# Altium project SOM_MODULE_LN_144201.PrjPcb (part 4 of 4)
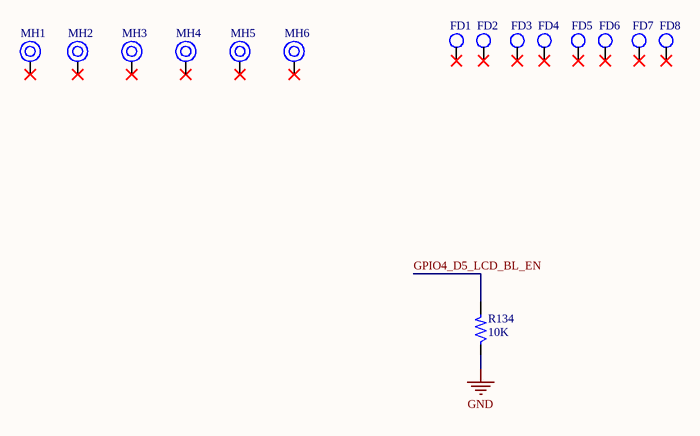
[diagram p19: Miscellaneous.SchDoc]

## Nets that join several sheets
GND: LPDDR4 SDRAM - 1 (107 pins), LPDDR4 SDRAM - 2 (107 pins), EMMC Flash memory (23 pins), WiFi module (27 pins), SOC SDRAM (22 pins), SOC Power Pins (287 pins), SOC EMMC, SDMMC, PCIE, ADC (11 pins), SOC Display, HDMI, EDP (17 pins), SOC USB, USIC (14 pins), SOC MIPI-CSI, I2C (6 pins), SOC PMU Controller (14 pins), SOC RGMII-SDIO, SPI (8 pins), USB C conn & ctrl (23 pins), ETH PHY IC (29 pins), BTNs and LEDs (Q1.2 SW2.1 SW3.1), PWR ICs (79 pins), PMIC (57 pins), DDR4 Conn (69 pins), Miscellaneous (R134.1)
VCC1V8_CAM: PMIC (C347.2 U20.31), DDR4 Conn (J5.107)
VCC3V3_S3: SOC USB, USIC (5 pins), SOC RGMII-SDIO, SPI (U8.J23), ETH PHY IC (C277.2 C278.2 R87.1), PMIC (C355.2 U20.7)
VCC3V3_S5: PWR ICs (C300.2 C301.2 C302.2 U15.5), PMIC (8 pins)
VCC3V3_SYS: WiFi module (5 pins), SOC PMU Controller (C236.2 U9.1), USB C conn & ctrl (C248.2 U10.4), BTNs and LEDs (SW1.1), PWR ICs (26 pins), PMIC (26 pins), DDR4 Conn (5 pins)
VCC5V0_SYS: WiFi module (C116.2 C117.2 U6.1 U6.6), USB C conn & ctrl (5 pins), BTNs and LEDs (R94.2), PWR ICs (5 pins), DDR4 Conn (J5.13 J5.15 J5.17 J5.19)
VCC_0V9: SOC SDRAM (FB4.2 FB6.2), SOC EMMC, SDMMC, PCIE, ADC (C197.2 C202.2 U8.L24 U8.W24), SOC Display, HDMI, EDP (6 pins), SOC USB, USIC (7 pins), SOC PMU Controller (FB1.1 U8.T24), PWR ICs (C321.2 L7.2 R121.2)
VCC_1V5: SOC RGMII-SDIO, SPI (C240.2 C243.2 U8.AC8 U8.N23), PMIC (C353.2 U20.2)
VCC_1V8: SOC EMMC, SDMMC, PCIE, ADC (8 pins), SOC Display, HDMI, EDP (7 pins), SOC USB, USIC (5 pins), SOC MIPI-CSI, I2C (12 pins), SOC PMU Controller (FB2.1 FB3.2), SOC RGMII-SDIO, SPI (C242.2 U8.AB8 U8.J22), PWR ICs (R99.2 R108.1 R116.2), PMIC (5 pins), DDR4 Conn (J5.29 J5.31)
VCC_3V0: SOC RGMII-SDIO, SPI (10 pins), PWR ICs (R112.1), PMIC (C344.2 C354.2 U20.15 U20.17)
VCC_DDR: LPDDR4 SDRAM - 1 (43 pins), LPDDR4 SDRAM - 2 (43 pins), SOC SDRAM (46 pins), PMIC (5 pins)
VCC_DDRC: LPDDR4 SDRAM - 1 (39 pins), LPDDR4 SDRAM - 2 (39 pins), PMIC (C363.2 Q5.2)
VCC_IN_CONN: PWR ICs (10 pins), PMIC (C362.1), DDR4 Conn (8 pins)
VCC_SDIO: SOC EMMC, SDMMC, PCIE, ADC (C195.2 U8.T23), PMIC (C351.2 U20.12)
VCCA1V8_CODEC: SOC RGMII-SDIO, SPI (5 pins), PMIC (C350.2 U20.5)
VDD_CENTER: SOC Power Pins (19 pins), PMIC (C329.2 C330.2 L9.1 U20.39)
VDD_CPU_B: SOC Power Pins (24 pins), PWR ICs (6 pins)
VDD_CPU_L: SOC Power Pins (16 pins), PMIC (C333.2 C334.2 L11.1 U20.29)
VDD_GPU: SOC Power Pins (37 pins), PWR ICs (5 pins)
VDD_LOG: SOC Power Pins (21 pins), PWR ICs (C306.2 L4.2 R107.2)
VDDQ: LPDDR4 SDRAM - 1 (R1.2 R2.1 R4.1), LPDDR4 SDRAM - 2 (R5.2 R6.1 R8.1)
ADC_IN0: SOC EMMC, SDMMC, PCIE, ADC (U8.AG26), DDR4 Conn (J5.26)
ADC_IN2: SOC EMMC, SDMMC, PCIE, ADC (U8.AG25), DDR4 Conn (J5.28)
ADC_IN3: SOC EMMC, SDMMC, PCIE, ADC (U8.AG28), DDR4 Conn (J5.30)
CPU_B_SLEEP: SOC RGMII-SDIO, SPI (U8.M27), PWR ICs (U13.A1)
DDR0_A0: LPDDR4 SDRAM - 1 (U1.H2 U1.R2), SOC SDRAM (U8.F2)
DDR0_A1: LPDDR4 SDRAM - 1 (U1.J2 U1.P2), SOC SDRAM (U8.F1)
DDR0_A2: LPDDR4 SDRAM - 1 (U1.H9 U1.R9), SOC SDRAM (U8.G1)
DDR0_A3: LPDDR4 SDRAM - 1 (U1.H10 U1.R10), SOC SDRAM (U8.G2)
DDR0_A4: LPDDR4 SDRAM - 1 (U1.H11 U1.R11), SOC SDRAM (U8.H2)
DDR0_A5: LPDDR4 SDRAM - 1 (U1.J11 U1.P11), SOC SDRAM (U8.H1)
DDR0_CKE0: LPDDR4 SDRAM - 1 (U1.J4 U1.P4), SOC SDRAM (U8.E1)
DDR0_CKE1: LPDDR4 SDRAM - 1 (U1.J5 U1.P5), SOC SDRAM (U8.F5)
DDR0_CLK1_N: LPDDR4 SDRAM - 1 (U1.P9), SOC SDRAM (U8.J5)
DDR0_CLK1_P: LPDDR4 SDRAM - 1 (U1.P8), SOC SDRAM (U8.H5)
DDR0_CLK_N: LPDDR4 SDRAM - 1 (U1.J9), SOC SDRAM (U8.J4)
DDR0_CLK_P: LPDDR4 SDRAM - 1 (U1.J8), SOC SDRAM (U8.H4)
DDR0_CS0N: LPDDR4 SDRAM - 1 (U1.H4), SOC SDRAM (U8.M6)
DDR0_CS1N: LPDDR4 SDRAM - 1 (U1.H3), SOC SDRAM (U8.B1)
DDR0_CS2N: LPDDR4 SDRAM - 1 (U1.R4), SOC SDRAM (U8.M5)
DDR0_CS3N: LPDDR4 SDRAM - 1 (U1.R3), SOC SDRAM (U8.C2)
DDR0_D0: LPDDR4 SDRAM - 1 (U1.B2), SOC SDRAM (U8.AB2)
DDR0_D1: LPDDR4 SDRAM - 1 (U1.C2), SOC SDRAM (U8.AB1)
DDR0_D2: LPDDR4 SDRAM - 1 (U1.E2), SOC SDRAM (U8.AA2)
DDR0_D3: LPDDR4 SDRAM - 1 (U1.F2), SOC SDRAM (U8.AA1)
DDR0_D4: LPDDR4 SDRAM - 1 (U1.F4), SOC SDRAM (U8.Y2)
DDR0_D5: LPDDR4 SDRAM - 1 (U1.E4), SOC SDRAM (U8.Y1)
DDR0_D6: LPDDR4 SDRAM - 1 (U1.C4), SOC SDRAM (U8.W1)
DDR0_D7: LPDDR4 SDRAM - 1 (U1.B4), SOC SDRAM (U8.W2)
DDR0_D8: LPDDR4 SDRAM - 1 (U1.B11), SOC SDRAM (U8.AF2)
DDR0_D9: LPDDR4 SDRAM - 1 (U1.C11), SOC SDRAM (U8.AE2)
DDR0_D10: LPDDR4 SDRAM - 1 (U1.E11), SOC SDRAM (U8.AF1)
DDR0_D11: LPDDR4 SDRAM - 1 (U1.F11), SOC SDRAM (U8.AD2)
DDR0_D12: LPDDR4 SDRAM - 1 (U1.F9), SOC SDRAM (U8.AE1)
DDR0_D13: LPDDR4 SDRAM - 1 (U1.E9), SOC SDRAM (U8.AD1)
DDR0_D14: LPDDR4 SDRAM - 1 (U1.C9), SOC SDRAM (U8.AC1)
DDR0_D15: LPDDR4 SDRAM - 1 (U1.B9), SOC SDRAM (U8.AC2)
DDR0_D16: LPDDR4 SDRAM - 1 (U1.AA2), SOC SDRAM (U8.V1)
DDR0_D17: LPDDR4 SDRAM - 1 (U1.Y2), SOC SDRAM (U8.V2)
DDR0_D18: LPDDR4 SDRAM - 1 (U1.V2), SOC SDRAM (U8.U1)
DDR0_D19: LPDDR4 SDRAM - 1 (U1.U2), SOC SDRAM (U8.U2)
DDR0_D20: LPDDR4 SDRAM - 1 (U1.U4), SOC SDRAM (U8.T1)
DDR0_D21: LPDDR4 SDRAM - 1 (U1.V4), SOC SDRAM (U8.T2)
DDR0_D22: LPDDR4 SDRAM - 1 (U1.Y4), SOC SDRAM (U8.R2)
DDR0_D23: LPDDR4 SDRAM - 1 (U1.AA4), SOC SDRAM (U8.R1)
DDR0_D24: LPDDR4 SDRAM - 1 (U1.AA11), SOC SDRAM (U8.P1)
DDR0_D25: LPDDR4 SDRAM - 1 (U1.Y11), SOC SDRAM (U8.P2)
DDR0_D26: LPDDR4 SDRAM - 1 (U1.V11), SOC SDRAM (U8.N1)
DDR0_D27: LPDDR4 SDRAM - 1 (U1.U11), SOC SDRAM (U8.M1)
DDR0_D28: LPDDR4 SDRAM - 1 (U1.U9), SOC SDRAM (U8.N2)
DDR0_D29: LPDDR4 SDRAM - 1 (U1.V9), SOC SDRAM (U8.L1)
DDR0_D30: LPDDR4 SDRAM - 1 (U1.Y9), SOC SDRAM (U8.M2)
DDR0_D31: LPDDR4 SDRAM - 1 (U1.AA9), SOC SDRAM (U8.L2)
DDR0_DM0: LPDDR4 SDRAM - 1 (U1.C3), SOC SDRAM (U8.Y5)
DDR0_DM1: LPDDR4 SDRAM - 1 (U1.C10), SOC SDRAM (U8.AC5)
DDR0_DM2: LPDDR4 SDRAM - 1 (U1.Y3), SOC SDRAM (U8.U5)
DDR0_DM3: LPDDR4 SDRAM - 1 (U1.Y10), SOC SDRAM (U8.P5)
DDR0_DQS0_N: LPDDR4 SDRAM - 1 (U1.E3), SOC SDRAM (U8.AA4)
DDR0_DQS0_P: LPDDR4 SDRAM - 1 (U1.D3), SOC SDRAM (U8.Y4)
DDR0_DQS1_N: LPDDR4 SDRAM - 1 (U1.E10), SOC SDRAM (U8.AD4)
DDR0_DQS1_P: LPDDR4 SDRAM - 1 (U1.D10), SOC SDRAM (U8.AC4)
DDR0_DQS2_N: LPDDR4 SDRAM - 1 (U1.W3), SOC SDRAM (U8.V4)
DDR0_DQS2_P: LPDDR4 SDRAM - 1 (U1.V3), SOC SDRAM (U8.U4)
DDR0_DQS3_N: LPDDR4 SDRAM - 1 (U1.V10), SOC SDRAM (U8.R4)
DDR0_DQS3_P: LPDDR4 SDRAM - 1 (U1.W10), SOC SDRAM (U8.P4)
DDR0_RST: LPDDR4 SDRAM - 1 (U1.T11), SOC SDRAM (U8.L7)
DDR1_A0: LPDDR4 SDRAM - 2 (U2.H2 U2.R2), SOC SDRAM (U8.B10)
DDR1_A1: LPDDR4 SDRAM - 2 (U2.J2 U2.P2), SOC SDRAM (U8.A10)
DDR1_A2: LPDDR4 SDRAM - 2 (U2.H9 U2.R9), SOC SDRAM (U8.B9)
DDR1_A3: LPDDR4 SDRAM - 2 (U2.H10 U2.R10), SOC SDRAM (U8.A9)
DDR1_A4: LPDDR4 SDRAM - 2 (U2.H11 U2.R11), SOC SDRAM (U8.B8)
DDR1_A5: LPDDR4 SDRAM - 2 (U2.J11 U2.P11), SOC SDRAM (U8.A8)
DDR1_CKE0: LPDDR4 SDRAM - 2 (U2.J4 U2.P4), SOC SDRAM (U8.A5)
DDR1_CKE1: LPDDR4 SDRAM - 2 (U2.J5 U2.P5), SOC SDRAM (U8.E6)
DDR1_CLK1_N: LPDDR4 SDRAM - 2 (U2.P9), SOC SDRAM (U8.E8)
DDR1_CLK1_P: LPDDR4 SDRAM - 2 (U2.P8), SOC SDRAM (U8.E9)
DDR1_CLK_N: LPDDR4 SDRAM - 2 (U2.J9), SOC SDRAM (U8.D8)
DDR1_CLK_P: LPDDR4 SDRAM - 2 (U2.J8), SOC SDRAM (U8.D9)
DDR1_CS0N: LPDDR4 SDRAM - 2 (U2.H4), SOC SDRAM (U8.F12)
DDR1_CS1N: LPDDR4 SDRAM - 2 (U2.H3), SOC SDRAM (U8.A2)
DDR1_CS2N: LPDDR4 SDRAM - 2 (U2.R4), SOC SDRAM (U8.F11)
DDR1_CS3N: LPDDR4 SDRAM - 2 (U2.R3), SOC SDRAM (U8.B3)
DDR1_D0: LPDDR4 SDRAM - 2 (U2.B2), SOC SDRAM (U8.B15)
DDR1_D1: LPDDR4 SDRAM - 2 (U2.C2), SOC SDRAM (U8.A15)
DDR1_D2: LPDDR4 SDRAM - 2 (U2.E2), SOC SDRAM (U8.B16)
DDR1_D3: LPDDR4 SDRAM - 2 (U2.F2), SOC SDRAM (U8.A16)
DDR1_D4: LPDDR4 SDRAM - 2 (U2.F4), SOC SDRAM (U8.B17)
DDR1_D5: LPDDR4 SDRAM - 2 (U2.E4), SOC SDRAM (U8.A17)
DDR1_D6: LPDDR4 SDRAM - 2 (U2.C4), SOC SDRAM (U8.A18)
DDR1_D7: LPDDR4 SDRAM - 2 (U2.B4), SOC SDRAM (U8.B18)
DDR1_D8: LPDDR4 SDRAM - 2 (U2.B11), SOC SDRAM (U8.B11)
DDR1_D9: LPDDR4 SDRAM - 2 (U2.C11), SOC SDRAM (U8.B12)
DDR1_D10: LPDDR4 SDRAM - 2 (U2.E11), SOC SDRAM (U8.A11)
DDR1_D11: LPDDR4 SDRAM - 2 (U2.F11), SOC SDRAM (U8.B13)
DDR1_D12: LPDDR4 SDRAM - 2 (U2.F9), SOC SDRAM (U8.A12)
DDR1_D13: LPDDR4 SDRAM - 2 (U2.E9), SOC SDRAM (U8.A13)
DDR1_D14: LPDDR4 SDRAM - 2 (U2.C9), SOC SDRAM (U8.A14)
DDR1_D15: LPDDR4 SDRAM - 2 (U2.B9), SOC SDRAM (U8.B14)
DDR1_D16: LPDDR4 SDRAM - 2 (U2.AA2), SOC SDRAM (U8.A19)
DDR1_D17: LPDDR4 SDRAM - 2 (U2.Y2), SOC SDRAM (U8.B19)
DDR1_D18: LPDDR4 SDRAM - 2 (U2.V2), SOC SDRAM (U8.A20)
DDR1_D19: LPDDR4 SDRAM - 2 (U2.U2), SOC SDRAM (U8.B20)
DDR1_D20: LPDDR4 SDRAM - 2 (U2.U4), SOC SDRAM (U8.A21)
DDR1_D21: LPDDR4 SDRAM - 2 (U2.V4), SOC SDRAM (U8.B21)
DDR1_D22: LPDDR4 SDRAM - 2 (U2.Y4), SOC SDRAM (U8.B22)
DDR1_D23: LPDDR4 SDRAM - 2 (U2.AA4), SOC SDRAM (U8.A22)
DDR1_D24: LPDDR4 SDRAM - 2 (U2.AA11), SOC SDRAM (U8.A23)
DDR1_D25: LPDDR4 SDRAM - 2 (U2.Y11), SOC SDRAM (U8.B23)
DDR1_D26: LPDDR4 SDRAM - 2 (U2.V11), SOC SDRAM (U8.A24)
DDR1_D27: LPDDR4 SDRAM - 2 (U2.U11), SOC SDRAM (U8.A25)
DDR1_D28: LPDDR4 SDRAM - 2 (U2.U9), SOC SDRAM (U8.B24)
DDR1_D29: LPDDR4 SDRAM - 2 (U2.V9), SOC SDRAM (U8.A26)
DDR1_D30: LPDDR4 SDRAM - 2 (U2.Y9), SOC SDRAM (U8.B25)
DDR1_D31: LPDDR4 SDRAM - 2 (U2.AA9), SOC SDRAM (U8.B26)
DDR1_DM0: LPDDR4 SDRAM - 2 (U2.C3), SOC SDRAM (U8.E17)
DDR1_DM1: LPDDR4 SDRAM - 2 (U2.C10), SOC SDRAM (U8.E14)
DDR1_DM2: LPDDR4 SDRAM - 2 (U2.Y3), SOC SDRAM (U8.E20)
DDR1_DM3: LPDDR4 SDRAM - 2 (U2.Y10), SOC SDRAM (U8.E23)
DDR1_DQS0_N: LPDDR4 SDRAM - 2 (U2.E3), SOC SDRAM (U8.D17)
DDR1_DQS0_P: LPDDR4 SDRAM - 2 (U2.D3), SOC SDRAM (U8.D18)
DDR1_DQS1_N: LPDDR4 SDRAM - 2 (U2.E10), SOC SDRAM (U8.D14)
DDR1_DQS1_P: LPDDR4 SDRAM - 2 (U2.D10), SOC SDRAM (U8.D15)
DDR1_DQS2_N: LPDDR4 SDRAM - 2 (U2.W3), SOC SDRAM (U8.D20)
DDR1_DQS2_P: LPDDR4 SDRAM - 2 (U2.V3), SOC SDRAM (U8.D21)
DDR1_DQS3_N: LPDDR4 SDRAM - 2 (U2.V10), SOC SDRAM (U8.D23)
DDR1_DQS3_P: LPDDR4 SDRAM - 2 (U2.W10), SOC SDRAM (U8.D24)
DDR1_RST: LPDDR4 SDRAM - 2 (U2.T11), SOC SDRAM (U8.G11)
EDP_TX0_N: SOC Display, HDMI, EDP (C205.1), DDR4 Conn (J5.249)
EDP_TX0_P: SOC Display, HDMI, EDP (C204.1), DDR4 Conn (J5.251)
EDP_TX1_N: SOC Display, HDMI, EDP (C207.1), DDR4 Conn (J5.243)
EDP_TX1_P: SOC Display, HDMI, EDP (C206.1), DDR4 Conn (J5.245)
EDP_TX2_N: SOC Display, HDMI, EDP (C209.1), DDR4 Conn (J5.237)
EDP_TX2_P: SOC Display, HDMI, EDP (C208.1), DDR4 Conn (J5.239)
EDP_TX3_N: SOC Display, HDMI, EDP (C213.1), DDR4 Conn (J5.231)
EDP_TX3_P: SOC Display, HDMI, EDP (C210.1), DDR4 Conn (J5.233)
EDPAUX_N: SOC Display, HDMI, EDP (U8.A28), DDR4 Conn (J5.257)
EDPAUX_P: SOC Display, HDMI, EDP (U8.B28), DDR4 Conn (J5.255)
EFUSE_VQPS_EN_H: SOC PMU Controller (U9.3), SOC RGMII-SDIO, SPI (U8.AK3)
EMMC_CLKO: EMMC Flash memory (U3.M5), SOC EMMC, SDMMC, PCIE, ADC (R19.2)
EMMC_CMD: EMMC Flash memory (U3.M6), SOC EMMC, SDMMC, PCIE, ADC (U8.J31)
EMMC_D0: EMMC Flash memory (U3.A3), SOC EMMC, SDMMC, PCIE, ADC (U8.J28)
EMMC_D1: EMMC Flash memory (U3.A4), SOC EMMC, SDMMC, PCIE, ADC (U8.J29)
EMMC_D2: EMMC Flash memory (U3.A5), SOC EMMC, SDMMC, PCIE, ADC (U8.J30)
EMMC_D3: EMMC Flash memory (U3.B2), SOC EMMC, SDMMC, PCIE, ADC (U8.J25)
EMMC_D4: EMMC Flash memory (U3.B3), SOC EMMC, SDMMC, PCIE, ADC (U8.J26)
EMMC_D5: EMMC Flash memory (U3.B4), SOC EMMC, SDMMC, PCIE, ADC (U8.J27)
EMMC_D6: EMMC Flash memory (U3.B5), SOC EMMC, SDMMC, PCIE, ADC (U8.L31)
EMMC_D7: EMMC Flash memory (U3.B6), SOC EMMC, SDMMC, PCIE, ADC (U8.K30)
EMMC_STRB: EMMC Flash memory (U3.H5), SOC EMMC, SDMMC, PCIE, ADC (U8.K31)
GPIO0_A2: SOC PMU Controller (U8.N24), DDR4 Conn (J5.37)
GPIO0_A6/PWM3A_IR: SOC PMU Controller (U8.P25), DDR4 Conn (J5.49)
GPIO0_B5/LED1_OUT: SOC PMU Controller (U8.P24), BTNs and LEDs (R95.1)
GPIO1_A0: SOC RGMII-SDIO, SPI (U8.R25), DDR4 Conn (J5.34)
GPIO1_A1: SOC RGMII-SDIO, SPI (U8.T31), DDR4 Conn (J5.36)
GPIO1_A2_CC_INT_L: SOC RGMII-SDIO, SPI (U8.R26), USB C conn & ctrl (U10.5)
GPIO1_A3: SOC RGMII-SDIO, SPI (U8.R27), DDR4 Conn (J5.38)
GPIO1_A4: SOC RGMII-SDIO, SPI (U8.R28), DDR4 Conn (J5.40)
GPIO1_B5_TP_RST: SOC RGMII-SDIO, SPI (U8.M24), DDR4 Conn (J5.82)
GPIO1_C2: SOC RGMII-SDIO, SPI (U8.N31), DDR4 Conn (J5.42)
GPIO1_C4_TP_INT: SOC RGMII-SDIO, SPI (U8.M29), DDR4 Conn (J5.84)
GPIO1_C6: SOC RGMII-SDIO, SPI (U8.L25), DDR4 Conn (J5.44)
GPIO1_C7: SOC RGMII-SDIO, SPI (U8.M31), DDR4 Conn (J5.46)
GPIO1_D0: SOC RGMII-SDIO, SPI (U8.L26), DDR4 Conn (J5.48)
GPIO2_A2: SOC MIPI-CSI, I2C (U8.H30), DDR4 Conn (J5.39)
GPIO2_A3: SOC MIPI-CSI, I2C (U8.F28), DDR4 Conn (J5.41)
GPIO2_A4: SOC MIPI-CSI, I2C (U8.H29), DDR4 Conn (J5.43)
GPIO2_A5: SOC MIPI-CSI, I2C (U8.F29), DDR4 Conn (J5.45)
GPIO2_A6: SOC MIPI-CSI, I2C (U8.H27), DDR4 Conn (J5.47)
GPIO2_B3_CIF_CLKOUTA: SOC MIPI-CSI, I2C (U8.H31), DDR4 Conn (J5.111)
GPIO4_C0/I2C3_SDA: SOC RGMII-SDIO, SPI (U8.AG6), DDR4 Conn (J5.68)
GPIO4_C1/I2C3_SCL: SOC RGMII-SDIO, SPI (U8.AL2), DDR4 Conn (J5.66)
GPIO4_C5/SPDIF_TX: SOC RGMII-SDIO, SPI (U8.AK1), DDR4 Conn (J5.50)
GPIO4_C6/PWM1: SOC RGMII-SDIO, SPI (U8.AL3), DDR4 Conn (J5.90)
GPIO4_D2: SOC RGMII-SDIO, SPI (U8.AH3), USB C conn & ctrl (U11.4)
GPIO4_D5_LCD_BL_EN: SOC RGMII-SDIO, SPI (U8.AJ3), DDR4 Conn (J5.78), Miscellaneous (R134.2)
GPIO4_D6_LCD_RST_H: SOC RGMII-SDIO, SPI (U8.AG4), DDR4 Conn (J5.80)
GPU_SLEEP: SOC RGMII-SDIO, SPI (U8.M25), PWR ICs (U18.A1)
HDMI_CEC: SOC RGMII-SDIO, SPI (U8.AD7), DDR4 Conn (J5.145)
HDMI_HPD: SOC Display, HDMI, EDP (D1.K R25.2 U8.AE15), DDR4 Conn (J5.147)
HDMI_TX0_N: SOC Display, HDMI, EDP (U8.AL17), DDR4 Conn (J5.157)
HDMI_TX0_P: SOC Display, HDMI, EDP (U8.AK17), DDR4 Conn (J5.159)
HDMI_TX1_N: SOC Display, HDMI, EDP (U8.AL18), DDR4 Conn (J5.163)
HDMI_TX1_P: SOC Display, HDMI, EDP (U8.AK18), DDR4 Conn (J5.165)
HDMI_TX2_N: SOC Display, HDMI, EDP (U8.AL19), DDR4 Conn (J5.169)
HDMI_TX2_P: SOC Display, HDMI, EDP (U8.AK19), DDR4 Conn (J5.171)
HDMI_TXCLK_N: SOC Display, HDMI, EDP (U8.AL16), DDR4 Conn (J5.151)
HDMI_TXCLK_P: SOC Display, HDMI, EDP (U8.AK16), DDR4 Conn (J5.153)
HOST0_D_N: SOC USB, USIC (U8.AB31), DDR4 Conn (J5.221)
HOST0_D_P: SOC USB, USIC (U8.AB30), DDR4 Conn (J5.219)
HOST1_D_N: SOC USB, USIC (U8.AA31), DDR4 Conn (J5.227)
HOST1_D_P: SOC USB, USIC (U8.AA30), DDR4 Conn (J5.225)
HP_DET_H: SOC RGMII-SDIO, SPI (U8.AH5), DDR4 Conn (J5.76)
I2C1_SCL: SOC RGMII-SDIO, SPI (R64.1 U8.Y6), DDR4 Conn (J5.53)
I2C1_SDA: SOC RGMII-SDIO, SPI (R63.1 U8.AG1), DDR4 Conn (J5.55)
I2C2_SCL: SOC MIPI-CSI, I2C (R38.1 U8.H25), DDR4 Conn (J5.59)
I2C2_SDA: SOC MIPI-CSI, I2C (R37.1 U8.G31), DDR4 Conn (J5.57)
I2C4_TPSCL: SOC RGMII-SDIO, SPI (R53.1 U8.P30), USB C conn & ctrl (U10.6), DDR4 Conn (J5.70)
I2C4_TPSDA: SOC RGMII-SDIO, SPI (R54.1 U8.P31), USB C conn & ctrl (U10.7), DDR4 Conn (J5.72)
I2C7_SCL_HDMI: SOC MIPI-CSI, I2C (R41.1 U8.H28), DDR4 Conn (J5.61)
I2C7_SDA_HDMI: SOC MIPI-CSI, I2C (R42.1 U8.G30), DDR4 Conn (J5.63)
I2C_SCL_PMIC: SOC RGMII-SDIO, SPI (R52.1 U8.N30), PWR ICs (U13.A3 U18.A3), PMIC (U20.19)
I2C_SDA_PMIC: SOC RGMII-SDIO, SPI (R55.1 U8.M26), PWR ICs (U13.B1 U18.B1), PMIC (U20.18)
I2S0_LRCK_RX: SOC RGMII-SDIO, SPI (U8.AF4), DDR4 Conn (J5.69)
I2S0_LRCK_TX: SOC RGMII-SDIO, SPI (U8.AJ2), DDR4 Conn (J5.71)
I2S0_SCLK: SOC RGMII-SDIO, SPI (U8.AG3), DDR4 Conn (J5.67)
I2S0_SDI0: SOC RGMII-SDIO, SPI (U8.Y7), DDR4 Conn (J5.73)
I2S0_SDI1SDO3: SOC RGMII-SDIO, SPI (U8.AE5), DDR4 Conn (J5.75)
I2S0_SDI2SDO2: SOC RGMII-SDIO, SPI (U8.AA6), DDR4 Conn (J5.77)
I2S0_SDI3SDO1: SOC RGMII-SDIO, SPI (U8.AH2), DDR4 Conn (J5.79)
I2S0_SDO0: SOC RGMII-SDIO, SPI (U8.AH1), DDR4 Conn (J5.81)
I2S1_LRCK_RX: SOC RGMII-SDIO, SPI (U8.AA7), DDR4 Conn (J5.91)
I2S1_LRCK_TX: SOC RGMII-SDIO, SPI (U8.AJ1), DDR4 Conn (J5.93)
I2S1_SCLK: SOC RGMII-SDIO, SPI (U8.AF3), DDR4 Conn (J5.89)
I2S1_SDI0: SOC RGMII-SDIO, SPI (U8.AD6), DDR4 Conn (J5.95)
I2S1_SDO0: SOC RGMII-SDIO, SPI (U8.AC6), DDR4 Conn (J5.97)
I2S_CLK: SOC RGMII-SDIO, SPI (U8.AC7), DDR4 Conn (J5.85)
LAN_LED0_AD0: ETH PHY IC (R80.1 U12.34), DDR4 Conn (J5.232)
LAN_LED0_AD1: ETH PHY IC (R78.2 U12.35), DDR4 Conn (J5.234)
LOG_DVS_PWM: SOC RGMII-SDIO, SPI (U8.M28), PWR ICs (R109.1 R112.2)
MAC_COL: SOC RGMII-SDIO, SPI (U8.D27), ETH PHY IC (R81.1 U12.33)
MAC_CRS: SOC RGMII-SDIO, SPI (U8.B27), ETH PHY IC (C267.2 R73.1 U12.29)
MAC_MCLK: SOC RGMII-SDIO, SPI (R56.2), ETH PHY IC (R74.1)
MAC_MDC: SOC RGMII-SDIO, SPI (U8.E29), ETH PHY IC (U12.30)
MAC_MDIO: SOC RGMII-SDIO, SPI (U8.G26), ETH PHY IC (R71.1 U12.31)
MAC_RXCLK: SOC RGMII-SDIO, SPI (U8.F25), ETH PHY IC (R76.1)
MAC_RXD0: SOC RGMII-SDIO, SPI (U8.E26), ETH PHY IC (R89.1 U12.14)
MAC_RXD1: SOC RGMII-SDIO, SPI (U8.F27), ETH PHY IC (R82.2 R83.1 U12.16)
MAC_RXD2: SOC RGMII-SDIO, SPI (U8.E30), ETH PHY IC (R91.1 U12.17)
MAC_RXD3: SOC RGMII-SDIO, SPI (U8.E25), ETH PHY IC (R93.1 U12.18)
MAC_RXDV: SOC RGMII-SDIO, SPI (U8.C27), ETH PHY IC (R79.2 U12.13)
MAC_RXER: SOC RGMII-SDIO, SPI (U8.F23), ETH PHY IC (R72.1 U12.20)
MAC_TXCLK: SOC RGMII-SDIO, SPI (R58.2), ETH PHY IC (R77.1)
MAC_TXD0: SOC RGMII-SDIO, SPI (R50.2), ETH PHY IC (U12.23)
MAC_TXD1: SOC RGMII-SDIO, SPI (R51.2), ETH PHY IC (U12.24)
MAC_TXD2: SOC RGMII-SDIO, SPI (R48.2), ETH PHY IC (U12.25)
MAC_TXD3: SOC RGMII-SDIO, SPI (R49.2), ETH PHY IC (U12.26)
MAC_TXEN: SOC RGMII-SDIO, SPI (R57.2), ETH PHY IC (U12.27)
MDI0_N: ETH PHY IC (U12.2), DDR4 Conn (J5.256)
MDI0_P: ETH PHY IC (U12.1), DDR4 Conn (J5.258)
MDI1_N: ETH PHY IC (U12.5), DDR4 Conn (J5.250)
MDI1_P: ETH PHY IC (U12.4), DDR4 Conn (J5.252)
MDI2_N: ETH PHY IC (U12.8), DDR4 Conn (J5.244)
MDI2_P: ETH PHY IC (U12.7), DDR4 Conn (J5.246)
MDI3_N: ETH PHY IC (U12.11), DDR4 Conn (J5.238)
MDI3_P: ETH PHY IC (U12.10), DDR4 Conn (J5.240)
MIPI_CSI0_PWM: SOC RGMII-SDIO, SPI (U8.AF8), DDR4 Conn (J5.101)
MIPI_CSI0_RST: SOC RGMII-SDIO, SPI (U8.AD9), DDR4 Conn (J5.99)
MIPI_CSI1_PWN: SOC PMU Controller (U8.V26), DDR4 Conn (J5.105)
MIPI_CSI1_RST: SOC PMU Controller (U8.U28), DDR4 Conn (J5.103)
MIPI_RX0_CLK_N: SOC MIPI-CSI, I2C (U8.AL13), DDR4 Conn (J5.127)
MIPI_RX0_CLK_P: SOC MIPI-CSI, I2C (U8.AK13), DDR4 Conn (J5.129)
MIPI_RX0_D0_N: SOC MIPI-CSI, I2C (U8.AL15), DDR4 Conn (J5.139)
MIPI_RX0_D0_P: SOC MIPI-CSI, I2C (U8.AK15), DDR4 Conn (J5.141)
MIPI_RX0_D1_N: SOC MIPI-CSI, I2C (U8.AL14), DDR4 Conn (J5.133)
MIPI_RX0_D1_P: SOC MIPI-CSI, I2C (U8.AK14), DDR4 Conn (J5.135)
MIPI_RX0_D2_N: SOC MIPI-CSI, I2C (U8.AL12), DDR4 Conn (J5.121)
MIPI_RX0_D2_P: SOC MIPI-CSI, I2C (U8.AK12), DDR4 Conn (J5.123)
MIPI_RX0_D3_N: SOC MIPI-CSI, I2C (U8.AL11), DDR4 Conn (J5.115)
MIPI_RX0_D3_P: SOC MIPI-CSI, I2C (U8.AK11), DDR4 Conn (J5.117)
MIPI_TX0_CLK_N: SOC Display, HDMI, EDP (U8.AH12), DDR4 Conn (J5.160)
MIPI_TX0_CLK_P: SOC Display, HDMI, EDP (U8.AG12), DDR4 Conn (J5.162)
MIPI_TX0_D0_N: SOC Display, HDMI, EDP (U8.AH15), DDR4 Conn (J5.172)
MIPI_TX0_D0_P: SOC Display, HDMI, EDP (U8.AG15), DDR4 Conn (J5.174)
MIPI_TX0_D1_N: SOC Display, HDMI, EDP (U8.AH14), DDR4 Conn (J5.166)
MIPI_TX0_D1_P: SOC Display, HDMI, EDP (U8.AG14), DDR4 Conn (J5.168)
MIPI_TX0_D2_N: SOC Display, HDMI, EDP (U8.AH11), DDR4 Conn (J5.154)
MIPI_TX0_D2_P: SOC Display, HDMI, EDP (U8.AG11), DDR4 Conn (J5.156)
MIPI_TX0_D3_N: SOC Display, HDMI, EDP (U8.AH9), DDR4 Conn (J5.148)
MIPI_TX0_D3_P: SOC Display, HDMI, EDP (U8.AG9), DDR4 Conn (J5.150)
MIPI_TX1/RX1_CLK_N: SOC MIPI-CSI, I2C (U8.AL8), DDR4 Conn (J5.128)
MIPI_TX1/RX1_CLK_P: SOC MIPI-CSI, I2C (U8.AK8), DDR4 Conn (J5.130)
MIPI_TX1/RX1_D0_N: SOC MIPI-CSI, I2C (U8.AL6), DDR4 Conn (J5.116)
MIPI_TX1/RX1_D0_P: SOC MIPI-CSI, I2C (U8.AK6), DDR4 Conn (J5.118)
MIPI_TX1/RX1_D1_N: SOC MIPI-CSI, I2C (U8.AL7), DDR4 Conn (J5.122)
MIPI_TX1/RX1_D1_P: SOC MIPI-CSI, I2C (U8.AK7), DDR4 Conn (J5.124)
MIPI_TX1/RX1_D2_N: SOC MIPI-CSI, I2C (U8.AL9), DDR4 Conn (J5.134)
MIPI_TX1/RX1_D2_P: SOC MIPI-CSI, I2C (U8.AK9), DDR4 Conn (J5.136)
MIPI_TX1/RX1_D3_N: SOC MIPI-CSI, I2C (U8.AL10), DDR4 Conn (J5.140)
MIPI_TX1/RX1_D3_P: SOC MIPI-CSI, I2C (U8.AK10), DDR4 Conn (J5.142)
OTP_OUT_H: SOC RGMII-SDIO, SPI (U8.P26), PWR ICs (R119.2)
PCIE_REF_CLK_N: SOC EMMC, SDMMC, PCIE, ADC (U8.AD30), DDR4 Conn (J5.226)
PCIE_REF_CLK_P: SOC EMMC, SDMMC, PCIE, ADC (U8.AD31), DDR4 Conn (J5.228)
PCIE_RX0_N: SOC EMMC, SDMMC, PCIE, ADC (U8.AF31), DDR4 Conn (J5.214)
PCIE_RX0_P: SOC EMMC, SDMMC, PCIE, ADC (U8.AF30), DDR4 Conn (J5.216)
PCIE_RX1_N: SOC EMMC, SDMMC, PCIE, ADC (U8.AH31), DDR4 Conn (J5.202)
PCIE_RX1_P: SOC EMMC, SDMMC, PCIE, ADC (U8.AH30), DDR4 Conn (J5.204)
PCIE_RX2_N: SOC EMMC, SDMMC, PCIE, ADC (U8.AC28), DDR4 Conn (J5.190)
PCIE_RX2_P: SOC EMMC, SDMMC, PCIE, ADC (U8.AC27), DDR4 Conn (J5.192)
PCIE_RX3_N: SOC EMMC, SDMMC, PCIE, ADC (U8.AF28), DDR4 Conn (J5.178)
PCIE_RX3_P: SOC EMMC, SDMMC, PCIE, ADC (U8.AF27), DDR4 Conn (J5.180)
PCIE_TX0_N: SOC EMMC, SDMMC, PCIE, ADC (U8.AE31), DDR4 Conn (J5.220)
PCIE_TX0_P: SOC EMMC, SDMMC, PCIE, ADC (U8.AE30), DDR4 Conn (J5.222)
PCIE_TX1_N: SOC EMMC, SDMMC, PCIE, ADC (U8.AG31), DDR4 Conn (J5.208)
PCIE_TX1_P: SOC EMMC, SDMMC, PCIE, ADC (U8.AG30), DDR4 Conn (J5.210)
PCIE_TX2_N: SOC EMMC, SDMMC, PCIE, ADC (U8.AA28), DDR4 Conn (J5.196)
PCIE_TX2_P: SOC EMMC, SDMMC, PCIE, ADC (U8.AA27), DDR4 Conn (J5.198)
PCIE_TX3_N: SOC EMMC, SDMMC, PCIE, ADC (U8.AD28), DDR4 Conn (J5.184)
PCIE_TX3_P: SOC EMMC, SDMMC, PCIE, ADC (U8.AD27), DDR4 Conn (J5.186)
PMIC_EXT_EN: PWR ICs (R103.2 U17.8 U19.2), PMIC (U20.55)
PMIC_INT_L: SOC RGMII-SDIO, SPI (U8.M30), PMIC (C360.2 U20.49)
PMIC_SLEEP_H: SOC RGMII-SDIO, SPI (U8.R30), PMIC (C361.2 Q6.1 U20.50)
PWM0_BL: SOC RGMII-SDIO, SPI (U8.AF5), DDR4 Conn (J5.88)
PWR_KEY: BTNs and LEDs (SW3.2), PMIC (R130.1), DDR4 Conn (J5.14)
PWR_KEY_L: SOC PMU Controller (U8.V27), PMIC (D5.A)
RECOVERY: SOC EMMC, SDMMC, PCIE, ADC (R22.2), BTNs and LEDs (SW2.2), DDR4 Conn (J5.20)
RESET_IN_H: BTNs and LEDs (SW1.2), PWR ICs (Q3.3), PMIC (C359.2 U20.6), DDR4 Conn (J5.22)
RESET_L: SOC PMU Controller (R45.1), PMIC (R128.1 U20.20)
RTC_BATT_IN: PMIC (D7.A1), DDR4 Conn (J5.18)
RTC_CLKO_SOC: SOC PMU Controller (U8.U31), PMIC (R126.1 U20.68)
SDIO0_CLK: SOC RGMII-SDIO, SPI (U8.AF7), DDR4 Conn (J5.112)
SDIO0_CMD: SOC RGMII-SDIO, SPI (U8.AH6), DDR4 Conn (J5.106)
SDIO0_D0: SOC RGMII-SDIO, SPI (U8.AD8), DDR4 Conn (J5.98)
SDIO0_D1: SOC RGMII-SDIO, SPI (U8.AK5), DDR4 Conn (J5.100)
SDIO0_D2: SOC RGMII-SDIO, SPI (U8.AG7), DDR4 Conn (J5.102)
SDIO0_D3: SOC RGMII-SDIO, SPI (U8.AE8), DDR4 Conn (J5.104)
SDIO0_DETN: SOC RGMII-SDIO, SPI (U8.AL4), DDR4 Conn (J5.108)
SDMMC0_CLK: WiFi module (U5.E1), SOC EMMC, SDMMC, PCIE, ADC (R18.2)
SDMMC0_CMD: WiFi module (U5.A2), SOC EMMC, SDMMC, PCIE, ADC (U8.V25)
SDMMC0_D0: WiFi module (U5.A1), SOC EMMC, SDMMC, PCIE, ADC (U8.Y27)
SDMMC0_D1: WiFi module (U5.B2), SOC EMMC, SDMMC, PCIE, ADC (U8.Y26)
SDMMC0_D2: WiFi module (U5.B1), SOC EMMC, SDMMC, PCIE, ADC (U8.Y28)
SDMMC0_D3: WiFi module (U5.C2), SOC EMMC, SDMMC, PCIE, ADC (U8.U27)
SDMMC0_DET_L: WiFi module (R39.2), SOC PMU Controller (U8.V28)
SPI1_CLK: SOC RGMII-SDIO, SPI (U8.P28), DDR4 Conn (J5.62)
SPI1_CSn0: SOC RGMII-SDIO, SPI (U8.P29), DDR4 Conn (J5.56)
SPI1_RXD/UART4_RX: SOC RGMII-SDIO, SPI (U8.P27), DDR4 Conn (J5.60)
SPI1_TXD/UART4_TX: SOC RGMII-SDIO, SPI (U8.R31), DDR4 Conn (J5.58)
TYPEC0_D_N: SOC USB, USIC (U8.AH23), USB C conn & ctrl (J3.A7 J3.B7)
TYPEC0_D_P: SOC USB, USIC (U8.AG23), USB C conn & ctrl (J3.A6 J3.B6)
TYPEC0_RX1_N: SOC USB, USIC (U8.AL21), USB C conn & ctrl (J3.B10)
TYPEC0_RX1_P: SOC USB, USIC (U8.AK21), USB C conn & ctrl (J3.B11)
TYPEC0_RX2_N: SOC USB, USIC (U8.AL23), USB C conn & ctrl (J3.A10)
TYPEC0_RX2_P: SOC USB, USIC (U8.AK23), USB C conn & ctrl (J3.A11)
TYPEC0_SBU1_DC_N: SOC USB, USIC (U8.AG17), USB C conn & ctrl (R66.1)
TYPEC0_SBU1_DC_P: SOC USB, USIC (U8.AH17), USB C conn & ctrl (R69.1)
TYPEC0_SBU1_N: SOC USB, USIC (U8.AL20), USB C conn & ctrl (C253.1)
TYPEC0_SBU1_P: SOC USB, USIC (U8.AK20), USB C conn & ctrl (C252.1)
TYPEC0_TX1_N: SOC USB, USIC (U8.AK22), USB C conn & ctrl (C254.1)
TYPEC0_TX1_P: SOC USB, USIC (U8.AL22), USB C conn & ctrl (C255.1)
TYPEC0_TX2_N: SOC USB, USIC (U8.AK24), USB C conn & ctrl (C256.1)
TYPEC0_TX2_P: SOC USB, USIC (U8.AL24), USB C conn & ctrl (C257.1)
TYPEC0_U2VBUSDET: SOC USB, USIC (R29.2), USB C conn & ctrl (D4.K R65.1)
TYPEC1_D_N: SOC USB, USIC (U8.AH24), DDR4 Conn (J5.177)
TYPEC1_D_P: SOC USB, USIC (U8.AG24), DDR4 Conn (J5.175)
TYPEC1_RX1_N: SOC USB, USIC (U8.AL25), DDR4 Conn (J5.189)
TYPEC1_RX1_P: SOC USB, USIC (U8.AK25), DDR4 Conn (J5.187)
TYPEC1_RX2_N: SOC USB, USIC (U8.AL27), DDR4 Conn (J5.201)
TYPEC1_RX2_P: SOC USB, USIC (U8.AK27), DDR4 Conn (J5.199)
TYPEC1_SBU1: SOC USB, USIC (U8.AK29), DDR4 Conn (J5.205)
TYPEC1_SBU1_DC: SOC USB, USIC (U8.AE24), DDR4 Conn (J5.211)
TYPEC1_SBU2: SOC USB, USIC (U8.AL29), DDR4 Conn (J5.207)
TYPEC1_SBU2_DC: SOC USB, USIC (U8.AF25), DDR4 Conn (J5.213)
TYPEC1_TX1_N: SOC USB, USIC (U8.AK26), DDR4 Conn (J5.183)
TYPEC1_TX1_P: SOC USB, USIC (U8.AL26), DDR4 Conn (J5.181)
TYPEC1_TX2_N: SOC USB, USIC (U8.AK28), DDR4 Conn (J5.195)
TYPEC1_TX2_P: SOC USB, USIC (U8.AL28), DDR4 Conn (J5.193)
TYPEC1_U2VBUSDET: SOC USB, USIC (R31.2), DDR4 Conn (J5.215)
UART2DBG_RX: SOC RGMII-SDIO, SPI (U8.AK2), DDR4 Conn (J5.54)
UART2DBG_TX: SOC RGMII-SDIO, SPI (U8.AJ4), DDR4 Conn (J5.52)
VDC_ONOFF: PMIC (R129.2), DDR4 Conn (J5.16)
VDD_CPU_B_FB: SOC Power Pins (U8.N18), PWR ICs (R100.1 U13.A4)
VDD_GPU_FB: SOC Power Pins (U8.T15), PWR ICs (R117.2 U18.A4)